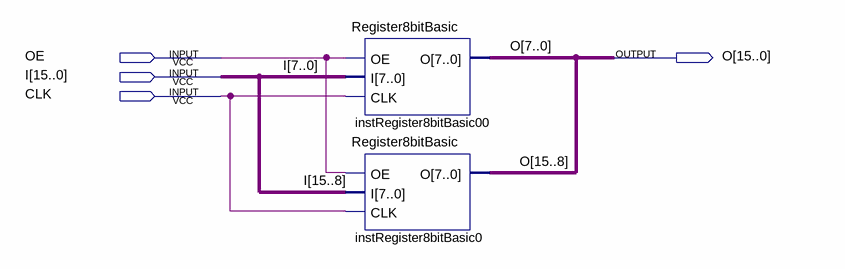
[diagram p0: schematic sheet]
// Quartus schematic Reg16bitBasic.bdf as structural Verilog: 2 symbols, 4 pins
module Reg16bitBasic (
  input  OE,
  input  [15:0] I,
  input  CLK,
  output [15:0] O
);

  Register8bitBasic instRegister8bitBasic00 (.OE(OE), .I(I[7:0]), .CLK(CLK), .O(O[7:0]));
  Register8bitBasic instRegister8bitBasic0 (.OE(OE), .I(I[15:8]), .CLK(CLK), .O(O[15:8]));
endmodule
